# EAGLE design C64_Keyb-Test (EAGLE 9.2.2)
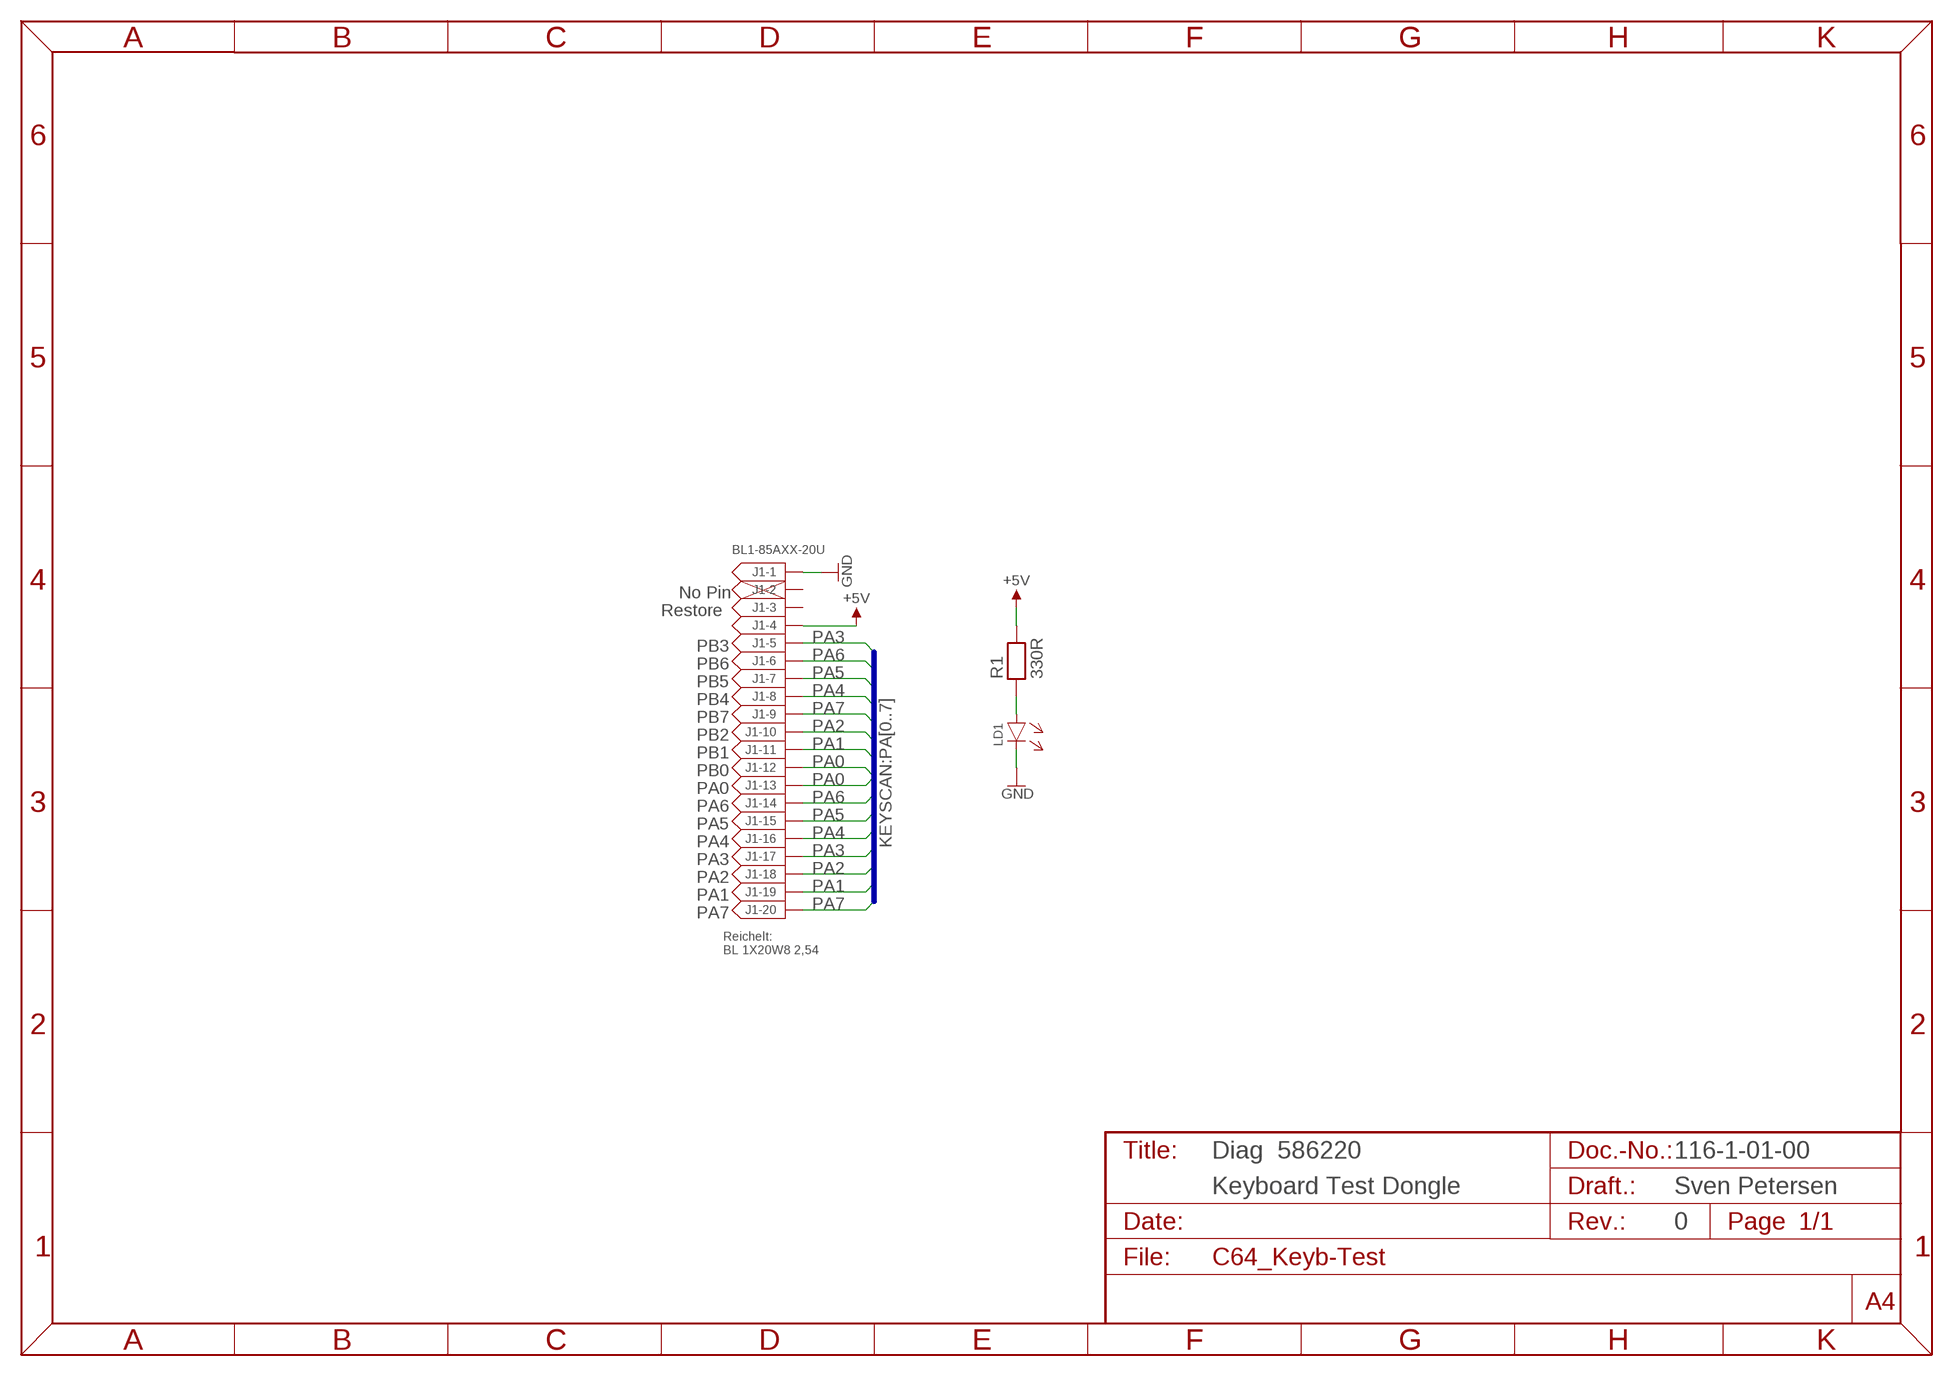
[diagram p0: schematic, sheet 1]

## Parts
J1  BL1-85AXX-20U  [BL1-85AXX-20U]
LD1  3MM  [3MM]
R1  330R  RES04  [R-10]

## Nets
+5V: J1.4 R1.2
GND: J1.1 LD1.C(K)
N$1: LD1.A R1.1
PA0: J1.12 J1.13
PA1: J1.11 J1.19
PA2: J1.10 J1.18
PA3: J1.5 J1.17
PA4: J1.8 J1.16
PA5: J1.7 J1.15
PA6: J1.6 J1.14
PA7: J1.9 J1.20
Unconnected: J1.2 J1.3

## Buses
KEYSCAN:PA[0..7]

## Notes on the sheet
- No Pin
- Restore
- PB3
- PB6
- PB5
- PB4
- PB7
- PB2
- PB1
- PB0
- PA0
- PA6
- PA5
- PA4
- PA3
- PA2
- PA1
- PA7
- Reichelt:
  BL 1X20W8 2,54
- Diag  586220 | 116-1-01-00
- Keyboard Test Dongle | Sven Petersen
- 0

## Library data of the parts
J1 = MPE_Garry:BL1-85AXX-20U
LD1 = LED:3MM
R1 = DISCRETE:RES04

## Board
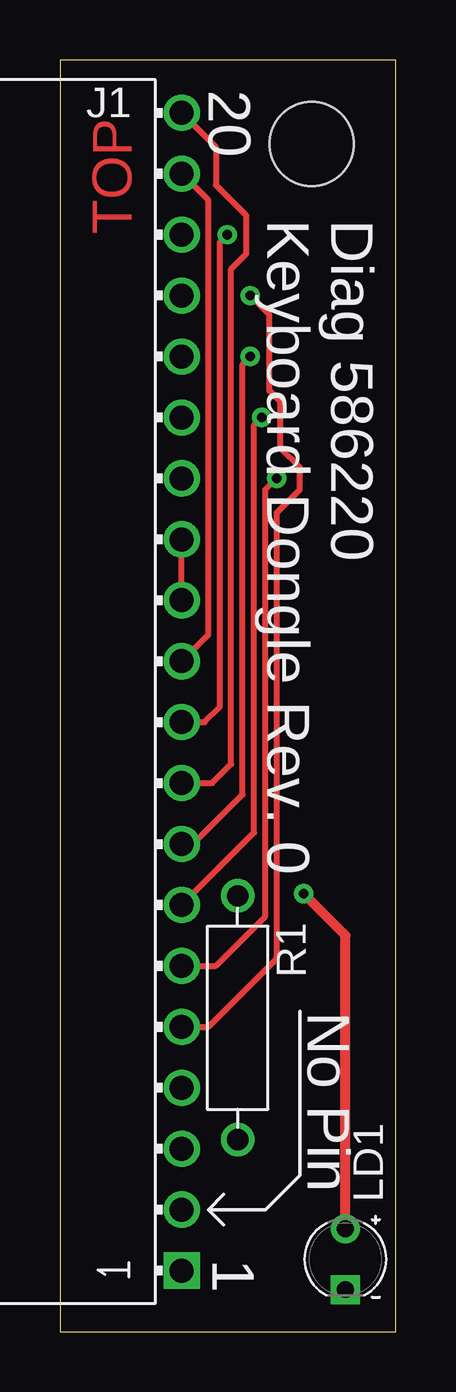
[diagram p1: board, top side]
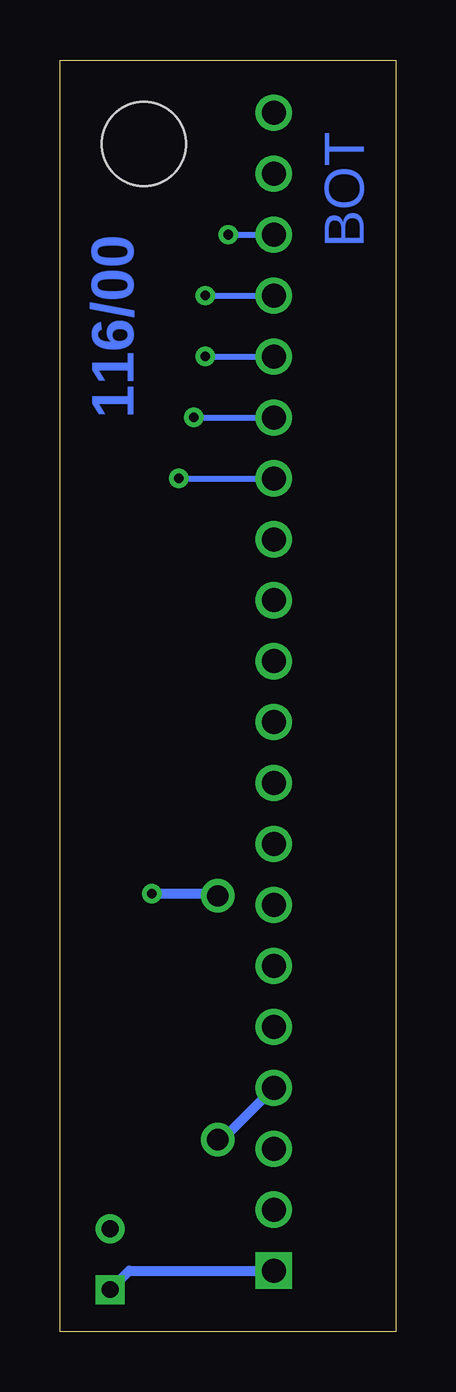
[diagram p2: board, bottom side, seen from below]

Size 14 x 53 mm. Coordinates in mm from the lower left corner, seen from the top.
Outline: 0,0 14,0 14,53 0,53 0,0
Copper layers (1*16): Top 0.035mm / dielectric 1.5mm / Bottom 0.035mm
Design rules "default *": minimum track width 6mil, minimum drill 0.35mm, track to track 6mil, track to pad 6mil, pad to pad 6mil, via to via 6mil, smd to smd 6mil, copper to edge 40mil, drill to drill 6mil, minimum pad ring 10mil, minimum via ring 8mil, stop-mask expansion 4mil, vias tented up to drill 24mil, thermal gap 10mil
Holes 3.5 mm at 10.5,49.5

### Footprints (pad centres in the part's own frame; a part is rotated, then mirrored left to right if it is on the bottom)
BL1-85AXX-20U = drill 1 square: 1 -24.13,0 | drill 1: 2 -21.59,0; 3 -19.05,0; 4 -16.51,0; 5 -13.97,0; 6 -11.43,0; 7 -8.89,0; 8 -6.35,0; 9 -3.81,0; 10 -1.27,0; 11 1.27,0; 12 3.81,0; 13 6.35,0; 14 8.89,0; 15 11.43,0; 16 13.97,0; 17 16.51,0; 18 19.05,0; 19 21.59,0; 20 24.13,0
3MM = drill 0.7: A -1.27,0 | drill 0.7 square: C 1.27,0
R-10 = drill 0.889 pad 1.397: 1 -5.08,0; 2 5.08,0

### Placement (x,y rotation side)
J1  5.08,26.67 90 top
LD1  11.91,3.02 270 top
R1  7.41,13.08 270 top
U$6  [2LAYER]  2.99,45.73 90 top
U$7  [PCB-TITLE/]  0,60 0 top  (outside the outline)

### Tracks (layer width: path | path; a pad name or v marks a point on that pad's centre or on a via)
+5V
  Bottom 0.406: J1.4 7.24,8 R1.2
GND
  Bottom 0.406: LD1.C 11.11,2.54 J1.1
N$1  (via drill 0.4)
  Top 0.406: LD1.A 11.91,16.51 v10.16,18.26
  Bottom 0.406: v10.16,18.26 7.51,18.26 R1.1
PA0
  Top 0.254: J1.12 J1.13
PA1
  Top 0.254: J1.11 6.19,29.05 6.19,47.15 J1.19
PA2  (via drill 0.4)
  Top 0.254: J1.10 6.03,25.4 6.67,26.04 6.67,45.4 v6.99,45.72
  Bottom 0.254: v6.99,45.72 J1.18
PA3  (via drill 0.4)
  Top 0.254: J1.5 6.19,12.7 9.05,15.56 9.05,34.13 10,35.08 10,36.04 9.21,36.83 9.21,38.73 8.73,39.21 8.73,42.39 v7.94,43.18
  Bottom 0.254: v7.94,43.18 J1.17
PA4  (via drill 0.4)
  Top 0.254: J1.8 5.56,20.32 7.62,22.38 7.62,40.32 v7.94,40.64
  Bottom 0.254: v7.94,40.64 J1.16
PA5  (via drill 0.4)
  Top 0.254: J1.7 8.1,20.8 8.1,37.78 v8.41,38.1
  Bottom 0.254: v8.41,38.1 J1.15
PA6  (via drill 0.4)
  Top 0.254: J1.6 6.51,15.24 8.57,17.3 8.57,35.08 v9.05,35.56
  Bottom 0.254: v9.05,35.56 J1.14
PA7
  Top 0.254: J1.9 6.35,22.86 7.14,23.65 7.14,44.29 7.78,44.93 7.78,46.51 6.51,47.78 6.51,49.37 J1.20

### Text on the board
Bottom: 116/00
tPlace: 20 | Diag 586220 / Keyboard Dongle Rev. 0 | No Pin | 1
Document: 116-2-01-00 | Sven Petersen / 2019 | 35µm | 2 | 0